# Altium schematic sheet I2C_VOLTAGE_TRANSLATOR.SchDoc
size A3
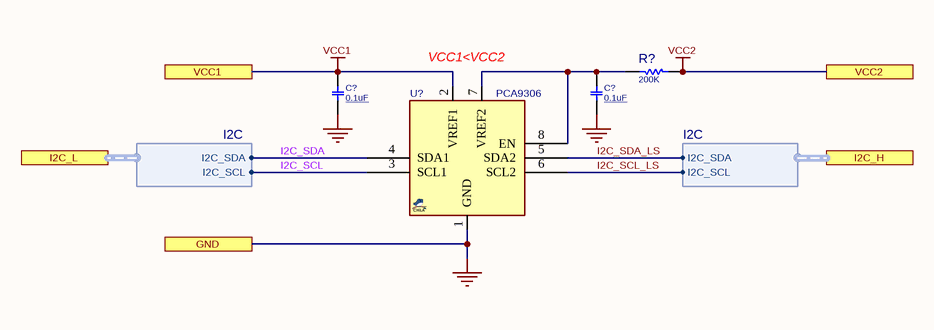
[diagram p0: I2C_VOLTAGE_TRANSLATOR.SchDoc]

## Parts
(Parts that share a designator on the sheet are numbered #1, #2 ... from top to bottom, then left to right.)
C?#1  0.1uF  [C0402]
C?#2  0.1uF  [C0402]
R?  200K  [R0402]
U?  PCA9306  [SOG65_8_3]

## Ports
GND, I2C_H (harness I2C), I2C_L (harness I2C), VCC1, VCC2

## Harnesses
I2C: I2C_SCL, I2C_SDA

## Nets
GND: C?#1.1 C?#2.1 U?.1(GND) ; port GND
VCC1: C?#1.2 U?.2(VREF1) ; port VCC1
VCC2: R?.1 ; port VCC2
I2C_SCL: U?.3(SCL1) ; port I2C_L.I2C_SCL
I2C_SCL_LS: U?.6(SCL2) ; port I2C_H.I2C_SCL
I2C_SDA: U?.4(SDA1) ; port I2C_L.I2C_SDA
I2C_SDA_LS: U?.5(SDA2) ; port I2C_H.I2C_SDA
NetC?#2_2: C?#2.2 R?.2 U?.7(VREF2) U?.8(EN)

## Notes on the sheet
- (near U?) VCC1<VCC2

## Library data of the parts
C?#1 C?#2 = CAP_SMD_MLCC_0402: CAP, MLCC, -F, -V, MATERIAL, -%, 0201; PARAM: -, -%; MANF_P#: MANF_PART#; PRICE: 100= 1$; MANF: -; PARAM2: -V; ASSEMBLY: ASSEMBLY; VALUE: 0.1uF
R? = RES_SMD: RESISTOR, SMD; PARAM: -W; DESC: DESCRIPTION; PARAM2: 1%; MANF_P#: -; MANF: -; ASSEMBLY: ASSEMBLY; PRICE: 100= 0.5$; VALUE: 200K
U? = PCA9306_SSOP8: Level Translator, I2C; MANF: Texas Instruments; MANF_P#: PCA9306DCTR; PARAM2: 1.2~3.3V1, 1.8~5.5V2; PRICE: 1=0.94, 10=0.829, 25=0.7488, 100=0.351, 250=0.34452, 500=0.338, 750=0.33151 (USD); VALUE: PCA9306